# EAGLE design Accelerometer - MMA8452Q (EAGLE 7.0.0)
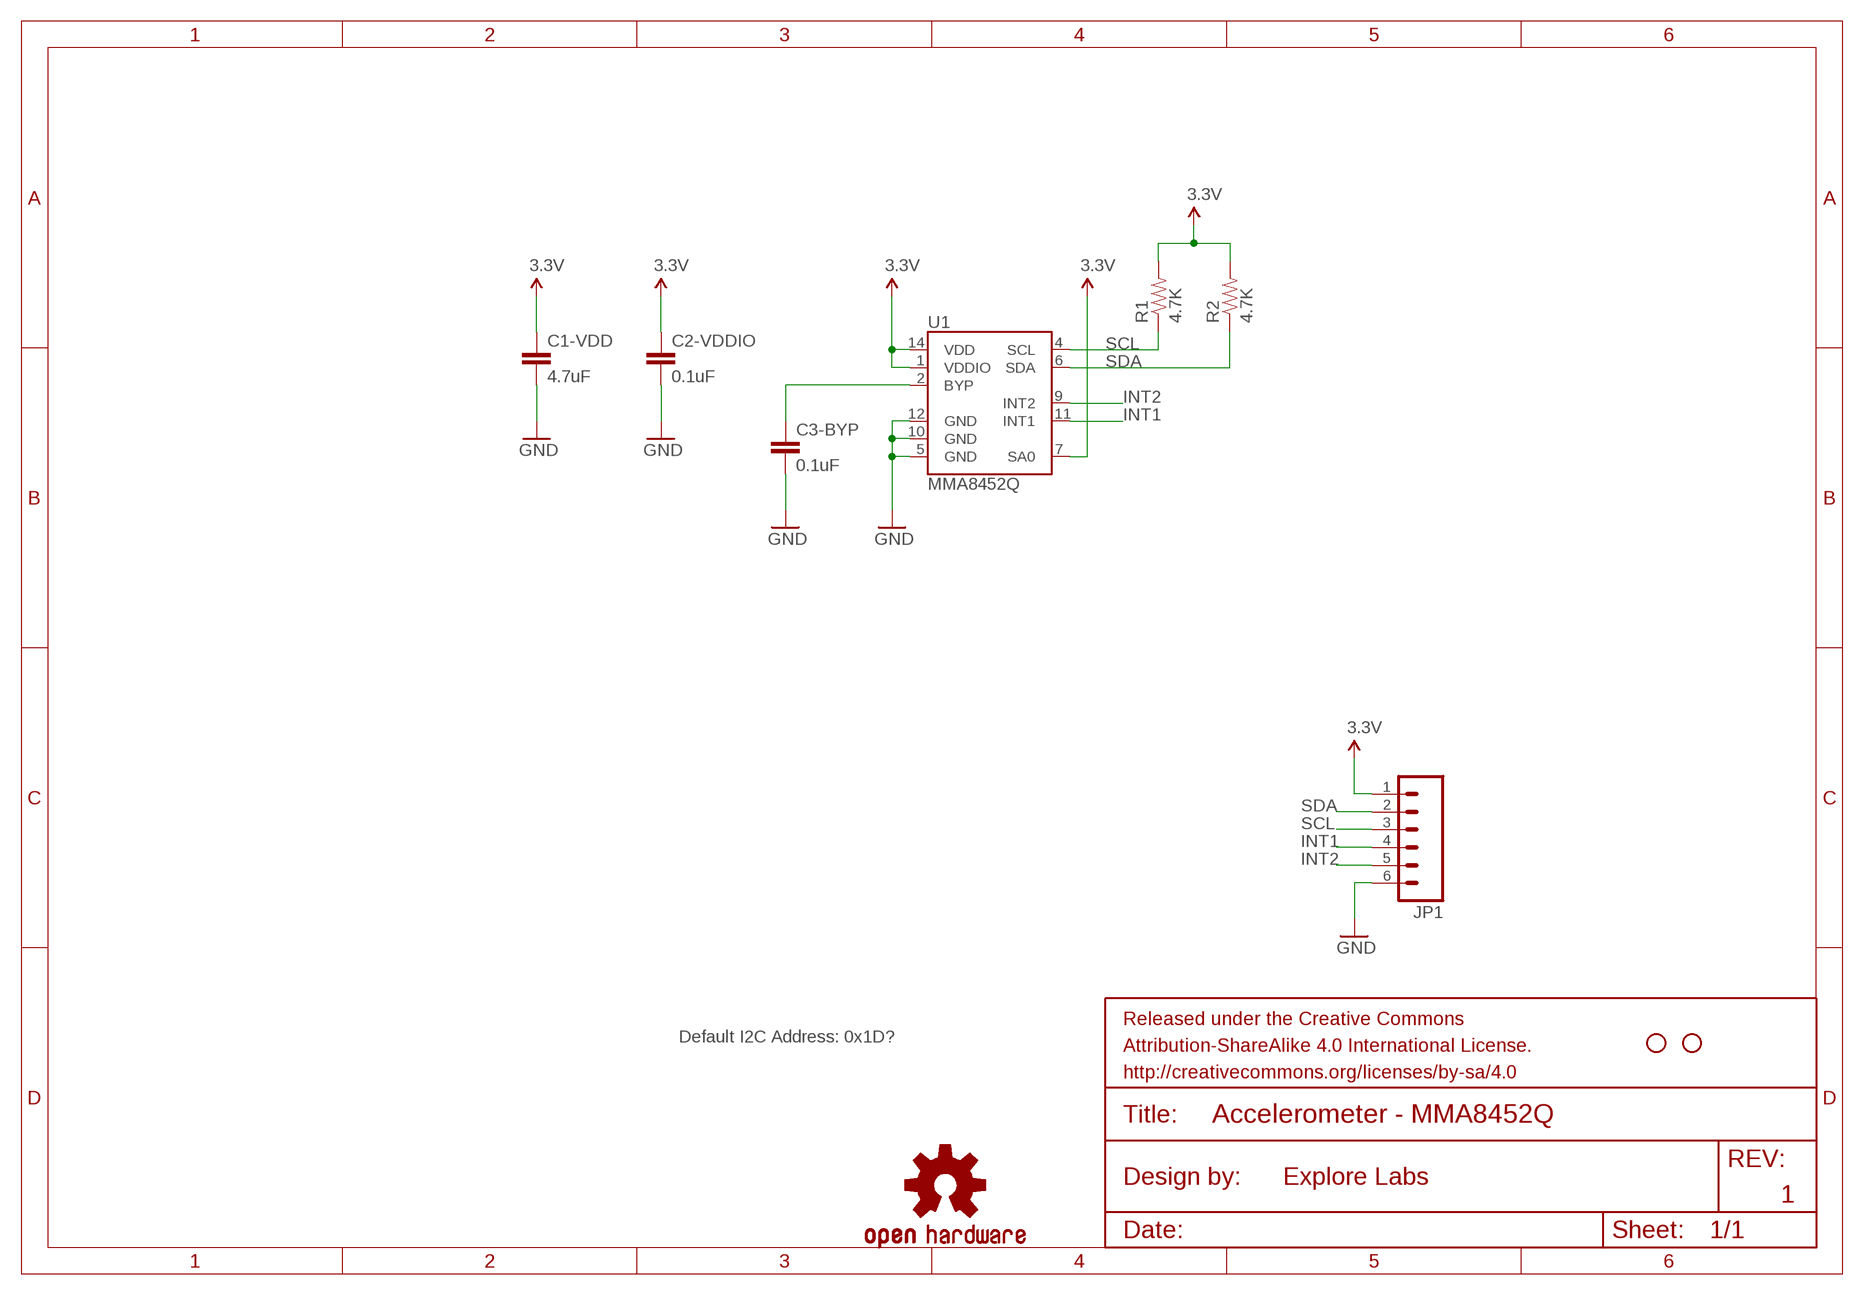
[diagram p0: schematic, sheet 1]

## Parts
C1-VDD  4.7uF  CAP0603-CAP  [0603-CAP]
C2-VDDIO  0.1uF  CAP0603-CAP  [0603-CAP]
C3-BYP  0.1uF  CAP0603-CAP  [0603-CAP]
JP1  M06SILK_FEMALE_PTH  [1X06]
LOGO1  OSHW-LOGOS  [OSHW-LOGO-S]
R1  4.7K  RESISTOR0603-RES  [0603-RES]
R2  4.7K  RESISTOR0603-RES  [0603-RES]
STANDOFF1  STAND-OFFTIGHT  [STAND-OFF-TIGHT]
STANDOFF2  STAND-OFFTIGHT  [STAND-OFF-TIGHT]
U1  MMA8452Q  [QFN-16_0.5MM]

## Nets
3.3V: C1-VDD.1 C2-VDDIO.1 JP1.1 R1.2 R2.2 U1.1(VDDIO) U1.7(SA0) U1.14(VDD)
GND: C1-VDD.2 C2-VDDIO.2 C3-BYP.2 JP1.6 U1.5(GND) U1.10(GND) U1.12(GND)
INT1: JP1.4 U1.11(INT1)
INT2: JP1.5 U1.9(INT2)
N$1: C3-BYP.1 U1.2(BYP)
SCL: JP1.3 R1.1 U1.4(SCL)
SDA: JP1.2 R2.1 U1.6(SDA)

## Notes on the sheet
- Default I2C Address: 0x1D?
- 1

## Library data of the parts
C1-VDD C2-VDDIO C3-BYP = SparkFun-Passives:CAP: Capacitor Standard 0603 ceramic capacitor, and 0.1" leaded capacitor.
JP1 = SparkFun-Connectors:M06: Header 6 Standard 6-pin 0.1" header. Use with straight break away headers (SKU : PRT-00116), right angle break away headers (PRT-00553), swiss pins (PRT-00743), machine pins (PRT-00117), and female headers (PRT-00115). Molex polarized connector foot print use with SKU : PRT-08094 with associated crimp pins and housings. NOTES ON THE VARIANTS LOCK and LOCK_LONGPADS... This footprint was designed to help hold the alignment of a through-hole component (i.e. 6-pin header) while soldering it into place. You may notice that each hole has been shifted either up or down by 0.005 of an inch from it's more standard position (which is a perfectly straight line). This slight alteration caused the pins (the squares in the middle) to touch the edges of the holes. Because they are alternating, it causes a "brace" to hold the component in place. 0.005 has proven to be the perfect amount of "off-center" position when using our standard breakaway headers. Although looks a little odd when you look at the bare footprint, once you have a header in there, the alteration is very hard to notice. Also,if you push a header all the way into place, it is covered up entirely on the bottom side. This idea of altering the position of holes to aid alignment will be further integrated into the Sparkfun Library for other footprints. It can help hold any component with 3 or more connection pins.; PROD_ID: CONN-08437
LOGO1 = Explore Labs EAGLE Library:OSHW-LOGO: Open Source Hardware Logo This logo indicates the piece of hardware it is found on incorporates a OSHW license and/or adheres to the definition of open source hardware found here: http://freedomdefined.org/OSHW
R1 R2 = SparkFun-Passives:RESISTOR: Resistor Basic schematic elements and footprints for 0603, 1206, and PTH resistors.
STANDOFF1 STANDOFF2 = SparkFun-Electromechanical:STAND-OFF: #4 Stand Off This is the mechanical footprint for a #4 phillips button head screw. Use the keepout ring to avoid running the screw head into surrounding components. SKU : PRT-00447
U1 = SparkFun-Sensors:MMA8452Q: MMA8452Q 3-Axis, 12/8-bit Digital Accelerometer Supply Voltage: 1.6-3.6V Range: +/- 2g, 4g, 8g Interface: I2C, 12-bit and 8-bit ODR: 1.56 Hz - 800 Hz Package: QFN-16 http://cache.freescale.com/files/sensors/doc/data_sheet/MMA8452Q.pdf; PROD_ID: IC-10769

## Board
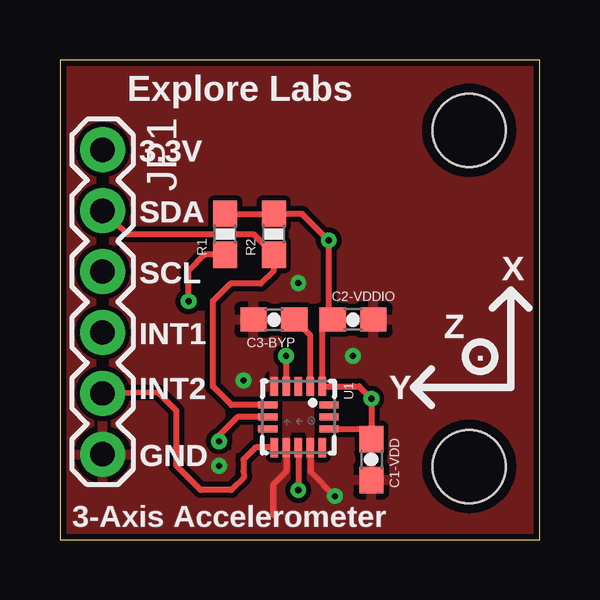
[diagram p1: board, top side]
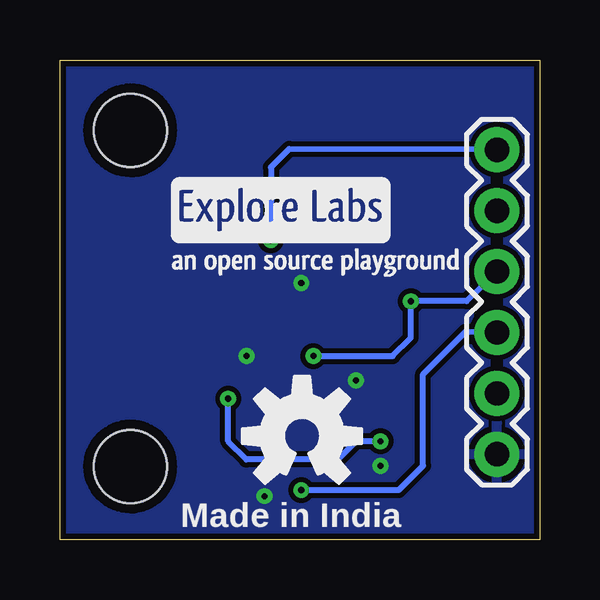
[diagram p2: board, bottom side, seen from below]

Size 20 x 20 mm. Coordinates in mm from the lower left corner, seen from the top.
Outline: 0,0 20,0 20,20 0,20 0,0
Copper layers (1*16): Top 0.035mm / dielectric 1.5mm / Bottom 0.035mm
Design rules "Explore Labs dru": minimum track width 10mil, minimum drill 10mil, track to track 8mil, track to pad 8mil, pad to pad 8mil, via to via 8mil, smd to smd 8mil, copper to edge 10mil, drill to drill 8mil, minimum pad ring 10mil, minimum via ring 8mil, stop-mask expansion 4mil, vias tented up to drill 18mil, thermal gap 10mil

### Footprints (pad centres in the part's own frame; a part is rotated, then mirrored left to right if it is on the bottom)
0603-CAP = smd 1.1 x 1: 1 -0.85,0; 2 0.85,0
1X06 = drill 1.016 pad 1.88: 1 0,0; 2 2.54,0; 3 5.08,0; 4 7.62,0; 5 10.16,0; 6 12.7,0
0603-RES = smd 1.1 x 1: 1 -0.85,0; 2 0.85,0
STAND-OFF-TIGHT = hole 3.048: 0,0
QFN-16_0.5MM = smd 0.8 x 0.3: 1 -1.275,1; 2 -1.275,0.5; 3 -1.275,0; 4 -1.275,-0.5; 5 -1.275,-1; 9 1.275,-1; 10 1.275,-0.5; 11 1.275,0; 12 1.275,0.5; 13 1.275,1 | smd 0.3 x 0.8: 6 -0.5,-1.275; 7 0,-1.275; 8 0.5,-1.275; 14 0.5,1.275; 15 0,1.275; 16 -0.5,1.275

### Placement (x,y rotation side)
C1-VDD  12.99,3.33 270 top
C2-VDDIO  12.22,9.18 0 top
C3-BYP  8.92,9.18 180 top
JP1  1.78,16.26 270 top
LOGO1  -24.13,-11.43 0 top  (outside the outline)
R1  6.89,12.73 90 top
R2  8.92,12.73 90 top
STANDOFF1  17.07,17.07 0 top
STANDOFF2  17.07,3.05 0 top
U1  9.94,5.11 270 top
U$1  [OSHW-LOGO-M-BOTTOM]  9.91,4.32 0 top
U$7  [EXLABS_LOGO_0.25]  15.75,10.16 0 bottom

### Tracks (layer width: path | path; a pad name or v marks a point on that pad's centre or on a via)
3.3V  (via drill 0.25)
  Top 0.254: U1.14 12.56,4.61 C1-VDD.1 v12.99,5.87 12.47,6.39 U1.1 10.94,8.74 C2-VDDIO.1 11.21,9.34 v11.21,12.48 10.1,13.58 R2.2 R1.2 | U1.7 7.4,5.11 6.64,4.35 v6.64,4.1
  Bottom 0.254: JP1.1 10.45,16.29 11.21,15.53 v11.21,12.48 | v6.64,4.1 7.65,4.1 8.41,3.33 12.22,3.33 12.99,4.1 v12.99,5.87
GND  (via drill 0.25)
  Top 0.254: U1.12 10.44,2.83 v11.46,1.81 | 9.43,3.83 U1.10 9.44,2.83 8.89,2.29 8.89,1.02
  other vias: 12.22,7.65 9.94,10.7 7.65,6.64 6.64,3.08
  pour Top: 0,20 20,20 20,0 0,0
  pour Bottom: 0,20 20,20 20,0 0,0
INT1  (via drill 0.25)
  Top 0.254: U1.11 v9.94,2.06
  Bottom 0.254: v9.94,2.06 5.87,2.06 4.86,3.08 4.86,6.89 3.08,8.67 JP1.4
INT2
  Top 0.254: JP1.5 4.1,6.13 4.86,5.37 4.86,3.08 5.87,2.06 7.14,2.06 7.67,2.59 7.65,2.86 7.65,3.33 8.15,3.84 U1.9
N$1
  Top 0.254: U1.2 10.44,8.51 C3-BYP.1
SCL  (via drill 0.25)
  Top 0.254: U1.4 v9.44,7.64 v9.43,7.65 | R1.1 6.04,11.88 5.33,11.18 5.33,9.97 v5.37,9.94
  Bottom 0.254: v9.43,7.65 6.13,7.65 5.37,8.41 v5.37,9.94 3.05,9.94 JP1.3
SDA
  Top 0.254: JP1.2 2.79,12.73 8.07,12.73 R2.1 | U1.6 7.15,5.61 6.38,6.38 6.38,9.94 7.11,10.67 8.38,10.67 8.92,11.21 R2.1 | 8.67,11.88 R2.1

### Text on the board
tPlace: 3.3V | SDA | SCL | INT1 | INT2 | GND
_tsilk: Explore Labs | 3.3V | SDA | SCL | X | INT1 | Z | . | INT2 | Y | GND | 3-Axis Accelerometer
_bsilk: Made in India